# EAGLE schematic Aux Board V6.0 (EAGLE 9.6.2)
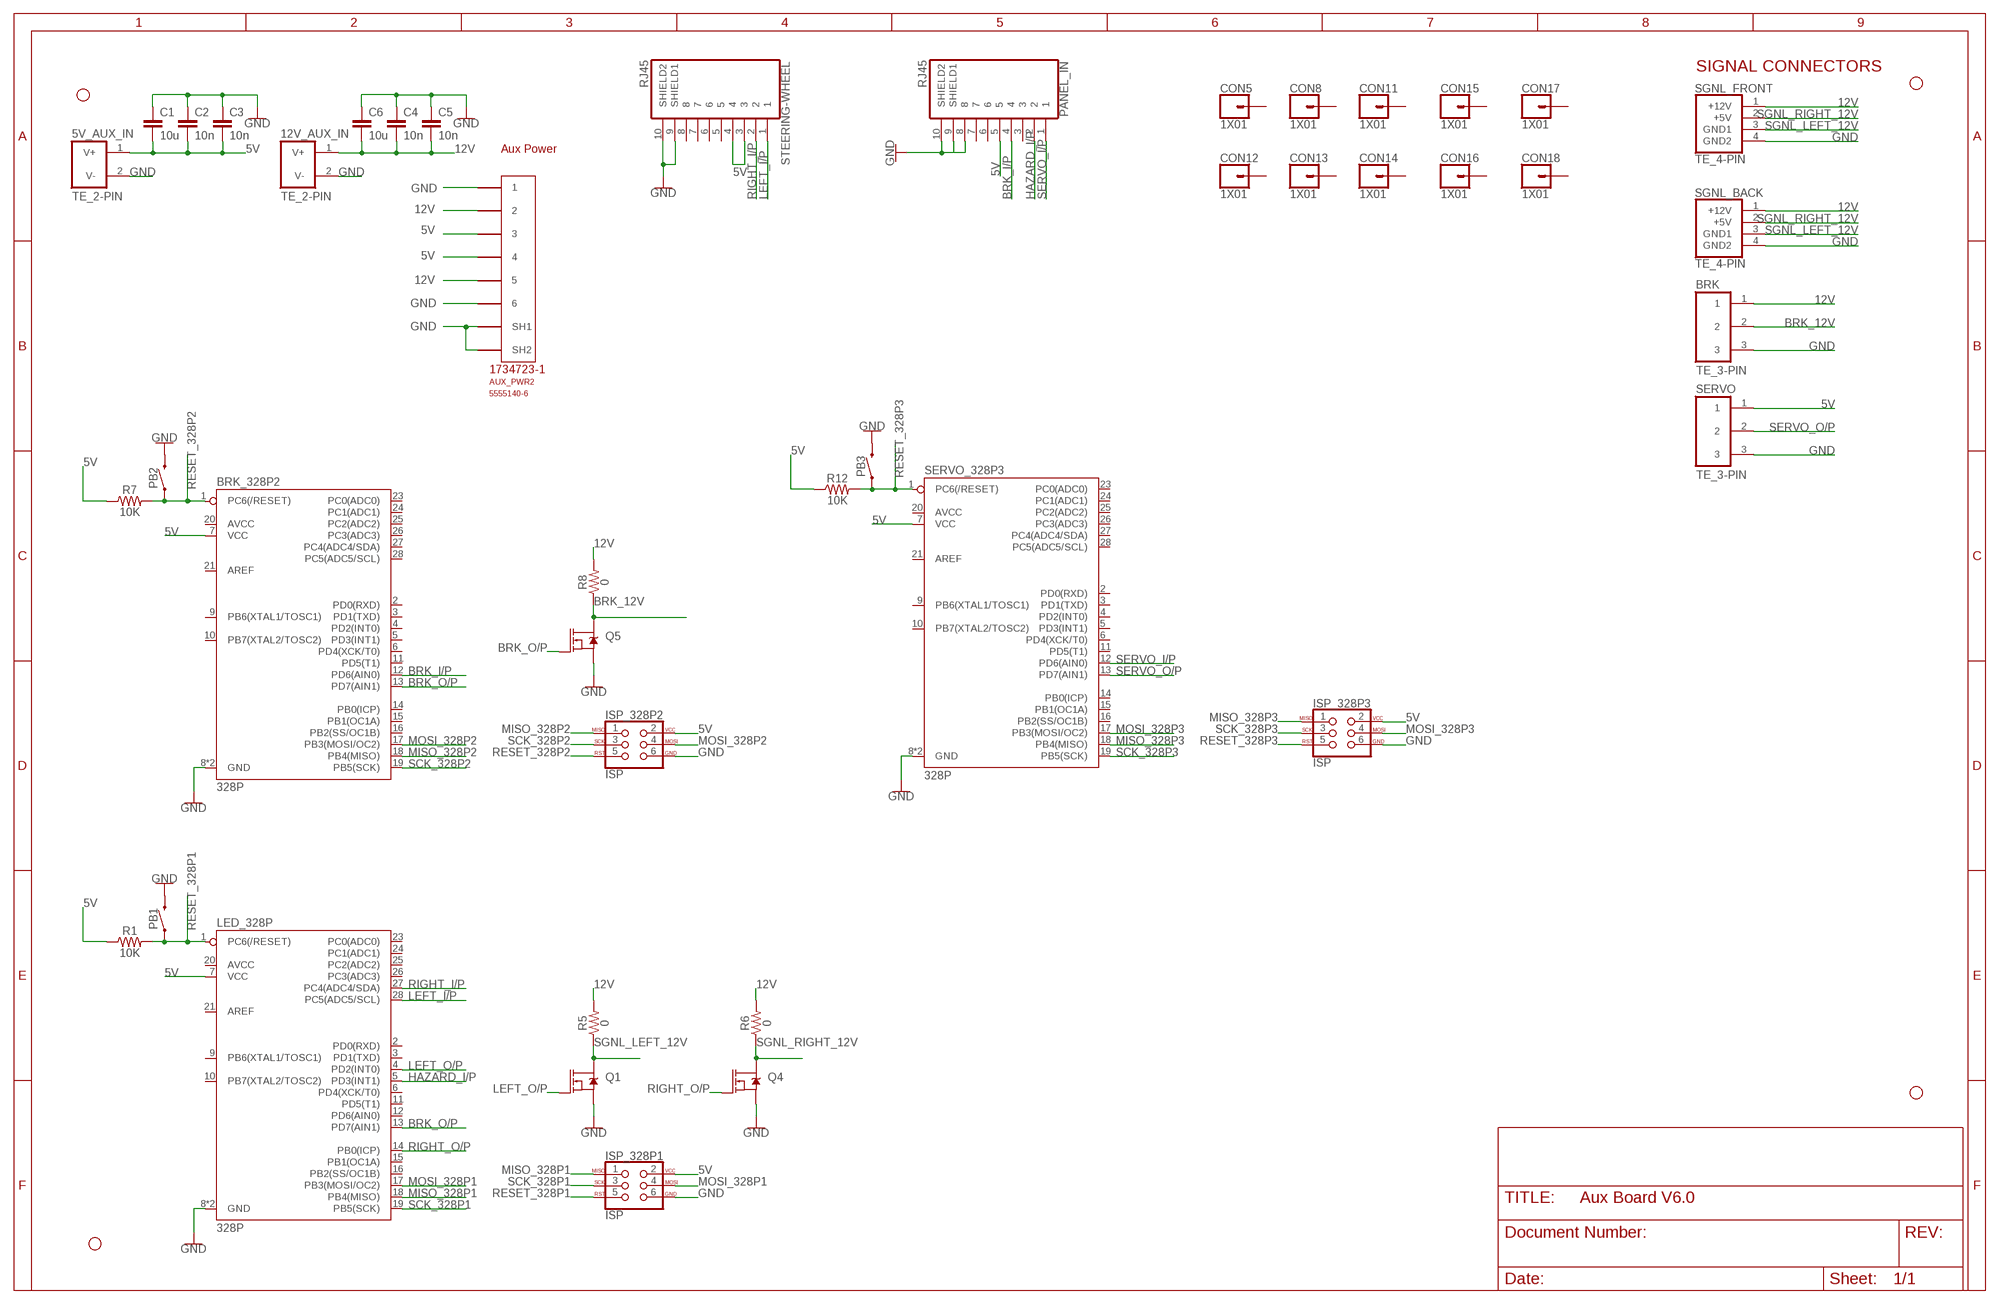
[diagram p0: schematic, sheet 1]

## Parts
5V_AUX_IN  TE_2-PIN  [TE_2-PIN]
12V_AUX_IN  TE_2-PIN  [TE_2-PIN]
AUX_PWR2  5555140-6  [1734723-1_RJ11]
BRK  TE_3-PIN  [TE_3-PIN]
BRK_328P2  328P  ATMEGA328P_DIP28  [DIP28]
C1  10u  CAPACITOR_0805  [0805]
C2  10n  CAPACITOR_0805  [0805]
C3  10n  CAPACITOR_0805  [0805]
C4  10n  CAPACITOR_0805  [0805]
C5  10n  CAPACITOR_0805  [0805]
C6  10u  CAPACITOR_0805  [0805]
CON5  1X01  [1X01]
CON8  1X01  [1X01]
CON11  1X01  [1X01]
CON12  1X01  [1X01]
CON13  1X01  [1X01]
CON14  1X01  [1X01]
CON15  1X01  [1X01]
CON16  1X01  [1X01]
CON17  1X01  [1X01]
CON18  1X01  [1X01]
H1  STAND-OFF  [STAND-OFF]
H2  STAND-OFF  [STAND-OFF]
H3  STAND-OFF  [STAND-OFF]
H4  STAND-OFF  [STAND-OFF]
ISP_328P1  ISP  [ISP_CONNECTOR]
ISP_328P2  ISP  [ISP_CONNECTOR]
ISP_328P3  ISP  [ISP_CONNECTOR]
LED_328P  328P  ATMEGA328P_DIP28  [DIP28]
PANEL_IN  RJ45  [RJ45]
PB1  PUSHBUTTON  [PUSHBUTTON]
PB2  PUSHBUTTON  [PUSHBUTTON]
PB3  PUSHBUTTON  [PUSHBUTTON]
Q1  MOSFET_NMOS_TO-263  [TO-263/D2PAK]
Q4  MOSFET_NMOS_TO-263  [TO-263/D2PAK]
Q5  MOSFET_NMOS_TO-263  [TO-263/D2PAK]
R1  10K  RESISTOR_0805  [0805]
R5  0  RESISTOR_0805  [0805]
R6  0  RESISTOR_0805  [0805]
R7  10K  RESISTOR_0805  [0805]
R8  0  RESISTOR_0805  [0805]
R12  10K  RESISTOR_0805  [0805]
SERVO  TE_3-PIN  [TE_3-PIN]
SERVO_328P3  328P  ATMEGA328P_DIP28  [DIP28]
SGNL_BACK  TE_4-PIN  [TE_4-PIN]
SGNL_FRONT  TE_4-PIN  [TE_4-PIN]
STEERING-WHEEL  RJ45  [RJ45]

## Nets
5V: 5V_AUX_IN.1(V+) AUX_PWR2.3 AUX_PWR2.4 BRK_328P2.7(VCC) C1.2 C2.2 C3.2 ISP_328P1.2 ISP_328P2.2 ISP_328P3.2 LED_328P.7(VCC) PANEL_IN.5 R1.1 R7.1 R12.1 SERVO.1 SERVO_328P3.7(VCC) STEERING-WHEEL.3 STEERING-WHEEL.4
12V: 12V_AUX_IN.1(V+) AUX_PWR2.2 AUX_PWR2.5 BRK.1 C4.2 C5.2 C6.2 R5.2 R6.2 R8.2 SGNL_BACK.1(+12V) SGNL_FRONT.1(+12V)
BRK_12V: BRK.2 Q5.2(D) R8.1
BRK_I/P: BRK_328P2.12(PD6(AIN0)) PANEL_IN.4
BRK_O/P: BRK_328P2.13(PD7(AIN1)) LED_328P.13(PD7(AIN1)) Q5.1(G)
GND: 5V_AUX_IN.2(V-) 12V_AUX_IN.2(V-) AUX_PWR2.1 AUX_PWR2.6 AUX_PWR2.SH1 AUX_PWR2.SH2 BRK.3 BRK_328P2.8(GND) BRK_328P2.22(GND) C1.1 C2.1 C3.1 C4.1 C5.1 C6.1 ISP_328P1.6 ISP_328P2.6 ISP_328P3.6 LED_328P.8(GND) LED_328P.22(GND) PANEL_IN.8 PANEL_IN.9(SHIELD1) PANEL_IN.10(SHIELD2) PB1.3 PB1.4 PB2.3 PB2.4 PB3.3 PB3.4 Q1.3(S) Q4.3(S) Q5.3(S) SERVO.3 SERVO_328P3.8(GND) SERVO_328P3.22(GND) SGNL_BACK.4(GND2) SGNL_FRONT.4(GND2) STEERING-WHEEL.9(SHIELD1) STEERING-WHEEL.10(SHIELD2)
HAZARD_I/P: LED_328P.5(PD3(INT1)) PANEL_IN.2
LEFT_I/P: LED_328P.28(PC5(ADC5/SCL)) STEERING-WHEEL.1
LEFT_O/P: LED_328P.4(PD2(INT0)) Q1.1(G)
MISO_328P1: ISP_328P1.1 LED_328P.18(PB4(MISO))
MISO_328P2: BRK_328P2.18(PB4(MISO)) ISP_328P2.1
MISO_328P3: ISP_328P3.1 SERVO_328P3.18(PB4(MISO))
MOSI_328P1: ISP_328P1.4 LED_328P.17(PB3(MOSI/OC2))
MOSI_328P2: BRK_328P2.17(PB3(MOSI/OC2)) ISP_328P2.4
MOSI_328P3: ISP_328P3.4 SERVO_328P3.17(PB3(MOSI/OC2))
RESET_328P1: ISP_328P1.5 LED_328P.1(PC6(/RESET)) PB1.1 PB1.2 R1.2
RESET_328P2: BRK_328P2.1(PC6(/RESET)) ISP_328P2.5 PB2.1 PB2.2 R7.2
RESET_328P3: ISP_328P3.5 PB3.1 PB3.2 R12.2 SERVO_328P3.1(PC6(/RESET))
RIGHT_I/P: LED_328P.27(PC4(ADC4/SDA)) STEERING-WHEEL.2
RIGHT_O/P: LED_328P.14(PB0(ICP)) Q4.1(G)
SCK_328P1: ISP_328P1.3 LED_328P.19(PB5(SCK))
SCK_328P2: BRK_328P2.19(PB5(SCK)) ISP_328P2.3
SCK_328P3: ISP_328P3.3 SERVO_328P3.19(PB5(SCK))
SERVO_I/P: PANEL_IN.1 SERVO_328P3.12(PD6(AIN0))
SERVO_O/P: SERVO.2 SERVO_328P3.13(PD7(AIN1))
SGNL_LEFT_12V: Q1.2(D) R5.1 SGNL_BACK.3(GND1) SGNL_FRONT.3(GND1)
SGNL_RIGHT_12V: Q4.2(D) R6.1 SGNL_BACK.2(+5V) SGNL_FRONT.2(+5V)
Unconnected: BRK_328P2.2(PD0(RXD)) BRK_328P2.3(PD1(TXD)) BRK_328P2.4(PD2(INT0)) BRK_328P2.5(PD3(INT1)) BRK_328P2.6(PD4(XCK/T0)) BRK_328P2.9(PB6(XTAL1/TOSC1)) BRK_328P2.10(PB7(XTAL2/TOSC2)) BRK_328P2.11(PD5(T1)) BRK_328P2.14(PB0(ICP)) BRK_328P2.15(PB1(OC1A)) BRK_328P2.16(PB2(SS/OC1B)) BRK_328P2.20(AVCC) BRK_328P2.21(AREF) BRK_328P2.23(PC0(ADC0)) BRK_328P2.24(PC1(ADC1)) BRK_328P2.25(PC2(ADC2)) BRK_328P2.26(PC3(ADC3)) BRK_328P2.27(PC4(ADC4/SDA)) BRK_328P2.28(PC5(ADC5/SCL)) CON5.1 CON8.1 CON11.1 CON12.1 CON13.1 CON14.1 CON15.1 CON16.1 CON17.1 CON18.1 LED_328P.2(PD0(RXD)) LED_328P.3(PD1(TXD)) LED_328P.6(PD4(XCK/T0)) LED_328P.9(PB6(XTAL1/TOSC1)) LED_328P.10(PB7(XTAL2/TOSC2)) LED_328P.11(PD5(T1)) LED_328P.12(PD6(AIN0)) LED_328P.15(PB1(OC1A)) LED_328P.16(PB2(SS/OC1B)) LED_328P.20(AVCC) LED_328P.21(AREF) LED_328P.23(PC0(ADC0)) LED_328P.24(PC1(ADC1)) LED_328P.25(PC2(ADC2)) LED_328P.26(PC3(ADC3)) PANEL_IN.3 PANEL_IN.6 PANEL_IN.7 SERVO_328P3.2(PD0(RXD)) SERVO_328P3.3(PD1(TXD)) SERVO_328P3.4(PD2(INT0)) SERVO_328P3.5(PD3(INT1)) SERVO_328P3.6(PD4(XCK/T0)) SERVO_328P3.9(PB6(XTAL1/TOSC1)) SERVO_328P3.10(PB7(XTAL2/TOSC2)) SERVO_328P3.11(PD5(T1)) SERVO_328P3.14(PB0(ICP)) SERVO_328P3.15(PB1(OC1A)) SERVO_328P3.16(PB2(SS/OC1B)) SERVO_328P3.20(AVCC) SERVO_328P3.21(AREF) SERVO_328P3.23(PC0(ADC0)) SERVO_328P3.24(PC1(ADC1)) SERVO_328P3.25(PC2(ADC2)) SERVO_328P3.26(PC3(ADC3)) SERVO_328P3.27(PC4(ADC4/SDA)) SERVO_328P3.28(PC5(ADC5/SCL)) STEERING-WHEEL.5 STEERING-WHEEL.6 STEERING-WHEEL.7 STEERING-WHEEL.8

## Notes on the sheet
- SIGNAL CONNECTORS
- Aux Power

## Library data of the parts
5V_AUX_IN 12V_AUX_IN = EcoCar-Connectors:TE_2-PIN: 2 Pin TE Mini-Universal MATE-N-LOK - Use for signals and power connections Part Number: 1-770966-0 Digikey Part Number: A32471-ND Matching Plug: A25587-ND Matching Crimps: A100828CT-ND
AUX_PWR2 = 5555140-6 RJ11:5555140-6
BRK SERVO = EcoCar-Connectors:TE_3-PIN: 3 Pin TE Mini-Universal MATE-N-LOK Part Number: 1-770967-0 Digikey Part Number: A32473-ND Matching Plug: A25588-ND Matching Crimps: A100828CT-ND
BRK_328P2 LED_328P SERVO_328P3 = EcoCar-Microcontrollers:ATMEGA328P_DIP28: ATmega328P Manufacturer: Microchip Part Number: ATMEGA328P-PU Digikey Part Number: ATMEGA328P-PU-ND; PROD_ID: IC-09136
C1-C6 = EcoCar-Passives:CAPACITOR_0805
CON5 CON8 CON11-CON18 = EcoCar-Connectors-2.54mm:1X01: 2.54mm (0.1") Header
H1-H4 = EcoCar-Miscellaneous:STAND-OFF: Stand Off Drill holes for mechanically mounting via screws, standoffs, etc. Note: Use the keepout ring to avoid running the screw head into surrounding components. Variant Overviews STAND-OFF - Mechanical footprint for a #4 phillips button head screw. STAND-OFF-TIGHT - Mechanical footprint for a #4 phillips button head screw, Example SparkFun Products Screw - Phillips Head (1/4", 4-40, 10 pack) <https://www.sparkfun.com/products/10453> (PRT-10453) Screw - Phillips Head (1/2", 4-40, 10 pack) <https://www.sparkfun.com/products/10452> (PRT-10452) Screw - Phillips Head (3/4", 4-40, 10 pack) <https://www.sparkfun.com/products/10451> (PRT-10451) Screw - Phillips Head (1", 4-40, 10 pack) <https://www.sparkfun.com/products/10450> (PRT-10450)
ISP_328P1-ISP_328P3 = EcoCar-Microcontrollers:ISP: ISP Header Use for programming microcontrollers such as the 328P
PANEL_IN STEERING-WHEEL = EcoCar-Connectors:RJ45: RJ45 Connector - Use for signals and low power connections Unshielded Part Number: RJHSE-5080 Unshielded Digikey Part Number: RJHSE-5080-ND Shielded Part Number: RJHSE5E80 Shielded Digikey Part Number: RJHSE5E80-ND
PB1-PB3 = EcoCar-Electromechanical:PUSHBUTTON: Pushbutton Manufacturer: TE Connectivity ALCOSWITCH Switches Part Number: 1825910-6 Digikey Part Number: 450-1650-ND
Q1 Q4 Q5 = EcoCar-Discrete-Semiconductors:MOSFET_NMOS_TO-263
R1 R5-R8 R12 = EcoCar-Passives:RESISTOR_0805
SGNL_BACK SGNL_FRONT = EcoCar-Connectors:TE_4-PIN: 4 Pin TE Mini-Universal MATE-N-LOK - Use for 12V and 5V connections Part Number: 1-770968-0 Digikey Part Number: A32474-ND Matching Plug: A25571-ND Matching Crimps: A100828CT-ND